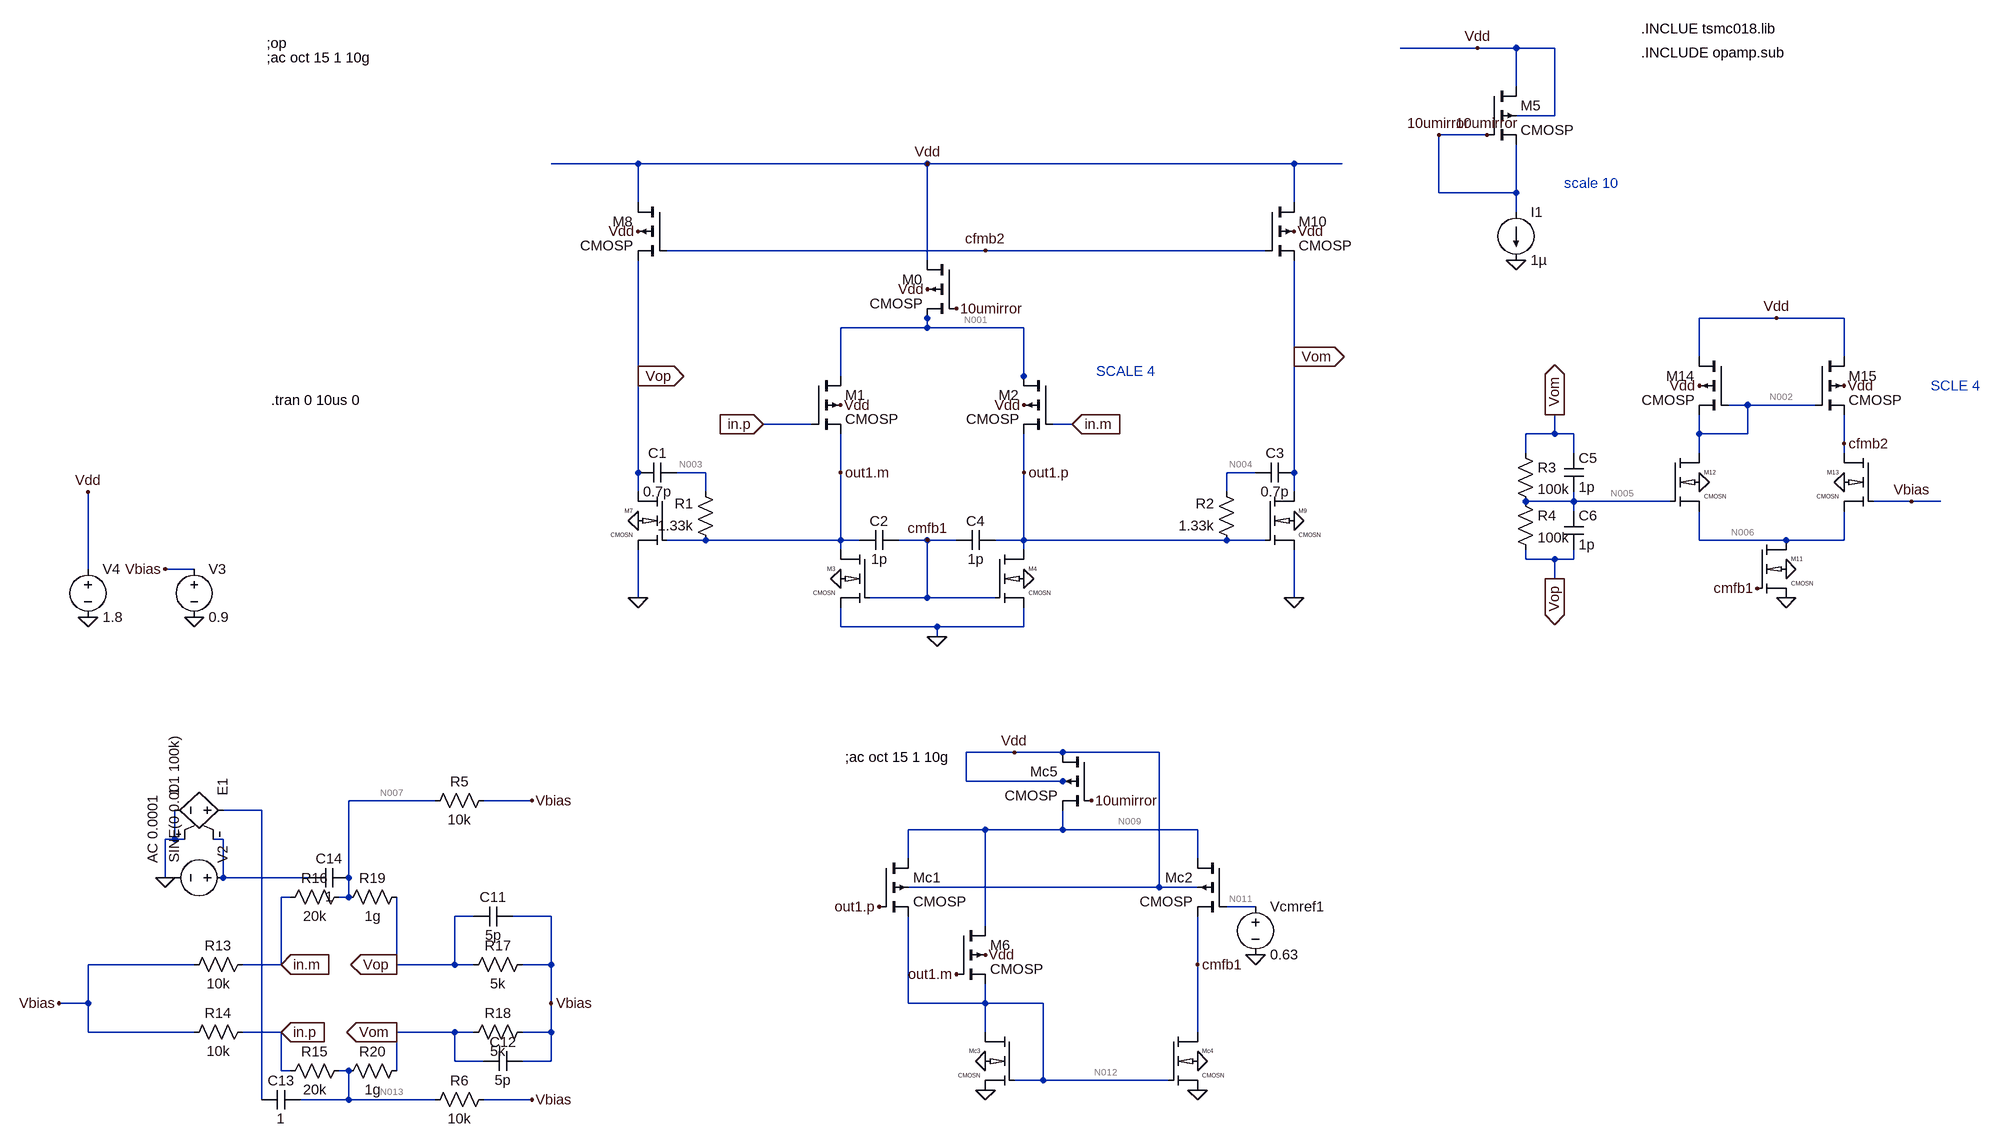
[diagram p0: schematic worked_1.asc]
worked_1.asc, the LTspice schematic file:
Version 4
SHEET 1 1904 1260
WIRE 896 -544 768 -544
WIRE 960 -544 896 -544
WIRE 1024 -544 960 -544
WIRE 960 -480 960 -544
WIRE 1024 -432 1024 -544
WIRE 1024 -432 960 -432
WIRE 912 -400 832 -400
WIRE -496 -352 -640 -352
WIRE -16 -352 -496 -352
WIRE 592 -352 -16 -352
WIRE 672 -352 592 -352
WIRE 832 -304 832 -400
WIRE 960 -304 960 -384
WIRE 960 -304 832 -304
WIRE -496 -288 -496 -352
WIRE 592 -288 592 -352
WIRE 960 -272 960 -304
WIRE 80 -208 -448 -208
WIRE 544 -208 80 -208
WIRE -16 -192 -16 -352
WIRE -16 -96 -16 -112
WIRE 1392 -96 1264 -96
WIRE 1504 -96 1392 -96
WIRE -16 -80 -16 -96
WIRE -16 -80 -160 -80
WIRE 144 -80 -16 -80
WIRE 592 -32 592 -192
WIRE 1264 -32 1264 -96
WIRE 1504 -32 1504 -96
WIRE -496 0 -496 -192
WIRE -160 0 -160 -80
WIRE 144 0 144 -80
WIRE 144 16 144 0
WIRE 1344 48 1312 48
WIRE 1456 48 1344 48
WIRE -208 80 -288 80
WIRE 224 80 192 80
WIRE 1024 96 1024 64
WIRE 1024 96 976 96
WIRE 1056 96 1024 96
WIRE 1264 96 1264 64
WIRE 1344 96 1344 48
WIRE 1344 96 1264 96
WIRE 1504 112 1504 64
WIRE 976 128 976 96
WIRE 1056 128 1056 96
WIRE 1264 128 1264 96
WIRE 1504 128 1504 112
WIRE -496 160 -496 0
WIRE -384 160 -432 160
WIRE -160 160 -160 96
WIRE 144 160 144 96
WIRE 528 160 480 160
WIRE 592 160 592 -32
WIRE -496 192 -496 160
WIRE -384 192 -384 160
WIRE 480 192 480 160
WIRE 592 192 592 160
WIRE 1056 208 1056 192
WIRE 1056 208 976 208
WIRE 1216 208 1056 208
WIRE 1616 208 1552 208
WIRE 1664 208 1616 208
WIRE 1056 224 1056 208
WIRE -384 272 -448 272
WIRE -160 272 -160 160
WIRE -160 272 -384 272
WIRE -128 272 -160 272
WIRE -16 272 -64 272
WIRE 32 272 -16 272
WIRE 144 272 144 160
WIRE 144 272 96 272
WIRE 480 272 144 272
WIRE 544 272 480 272
WIRE 1264 272 1264 224
WIRE 1408 272 1264 272
WIRE 1504 272 1504 224
WIRE 1504 272 1408 272
WIRE -160 288 -160 272
WIRE 144 288 144 272
WIRE 976 304 976 288
WIRE 1024 304 976 304
WIRE 1056 304 1056 288
WIRE 1056 304 1024 304
WIRE -1408 320 -1408 192
WIRE -1232 320 -1280 320
WIRE 1024 336 1024 304
WIRE -496 368 -496 288
WIRE -16 368 -16 272
WIRE -16 368 -112 368
WIRE 96 368 -16 368
WIRE 592 368 592 288
WIRE -160 416 -160 384
WIRE 0 416 -160 416
WIRE 144 416 144 384
WIRE 144 416 0 416
WIRE 0 432 0 416
WIRE 128 624 48 624
WIRE 208 624 128 624
WIRE 368 624 208 624
WIRE 48 672 48 624
WIRE 208 672 48 672
WIRE 224 672 208 672
WIRE -832 704 -976 704
WIRE -672 704 -752 704
WIRE -1120 720 -1184 720
WIRE 80 752 -48 752
WIRE 208 752 208 720
WIRE 208 752 80 752
WIRE 432 752 208 752
WIRE -1264 768 -1264 720
WIRE -1264 768 -1280 768
WIRE -1248 768 -1264 768
WIRE -1184 768 -1200 768
WIRE -48 800 -48 752
WIRE 432 800 432 752
WIRE -1280 832 -1280 768
WIRE -1264 832 -1280 832
WIRE -1184 832 -1184 768
WIRE -1040 832 -1184 832
WIRE -976 832 -976 704
WIRE 368 848 368 624
WIRE 368 848 -48 848
WIRE 432 848 368 848
WIRE -1072 864 -1088 864
WIRE -976 864 -976 832
WIRE -976 864 -992 864
WIRE 528 880 480 880
WIRE -768 896 -800 896
WIRE -640 896 -704 896
WIRE 80 912 80 752
WIRE -1232 976 -1408 976
WIRE -1088 976 -1088 864
WIRE -1088 976 -1152 976
WIRE -896 976 -896 864
WIRE -800 976 -800 896
WIRE -800 976 -896 976
WIRE -768 976 -800 976
WIRE -640 976 -640 896
WIRE -640 976 -688 976
WIRE 432 976 432 896
WIRE -1408 1040 -1408 976
WIRE -1408 1040 -1456 1040
WIRE -640 1040 -640 976
WIRE -48 1040 -48 896
WIRE 80 1040 80 1008
WIRE 80 1040 -48 1040
WIRE 176 1040 80 1040
WIRE -1408 1088 -1408 1040
WIRE -1232 1088 -1408 1088
WIRE -1088 1088 -1152 1088
WIRE -800 1088 -896 1088
WIRE -768 1088 -800 1088
WIRE -640 1088 -640 1040
WIRE -640 1088 -688 1088
WIRE 80 1088 80 1040
WIRE 432 1088 432 976
WIRE -800 1136 -800 1088
WIRE -752 1136 -800 1136
WIRE -640 1136 -640 1088
WIRE -640 1136 -688 1136
WIRE -1088 1152 -1088 1088
WIRE -1072 1152 -1088 1152
WIRE -976 1152 -992 1152
WIRE -896 1152 -896 1088
WIRE 176 1168 176 1040
WIRE 176 1168 128 1168
WIRE 384 1168 176 1168
WIRE -1120 1200 -1120 720
WIRE -976 1200 -976 1152
WIRE -976 1200 -1056 1200
WIRE -832 1200 -976 1200
WIRE -672 1200 -752 1200
FLAG 224 80 in.m
IOPIN 224 80 In
FLAG -288 80 in.p
IOPIN -288 80 In
FLAG -160 160 out1.m
FLAG 144 160 out1.p
FLAG 960 -192 0
FLAG 432 1184 0
FLAG 80 1184 0
FLAG 528 960 0
FLAG 80 1136 0
FLAG 432 1136 0
FLAG 896 -544 Vdd
FLAG 32 992 out1.m
FLAG -96 880 out1.p
FLAG -16 272 cmfb1
FLAG 432 976 cmfb1
FLAG 80 960 Vdd
FLAG 128 624 Vdd
FLAG 256 704 10umirror
FLAG 32 -112 10umirror
FLAG -16 -144 Vdd
FLAG 912 -400 10umirror
FLAG 832 -400 10umirror
FLAG 0 432 0
FLAG 144 336 0
FLAG -160 336 0
FLAG -1408 400 0
FLAG -496 368 0
FLAG 592 368 0
FLAG -1408 192 Vdd
FLAG 80 -208 cfmb2
FLAG 592 -32 Vom
IOPIN 592 -32 Out
FLAG -496 0 Vop
IOPIN -496 0 Out
FLAG -16 -352 Vdd
FLAG -160 48 Vdd
FLAG 144 48 Vdd
FLAG -496 240 0
FLAG 592 240 0
FLAG -496 -240 Vdd
FLAG 592 -240 Vdd
FLAG 1392 -96 Vdd
FLAG 1408 368 0
FLAG 1408 320 0
FLAG 1504 176 0
FLAG 1264 176 0
FLAG 1264 16 Vdd
FLAG 1504 16 Vdd
FLAG 1360 352 cmfb1
FLAG 1504 112 cfmb2
FLAG 1024 64 Vom
IOPIN 1024 64 Out
FLAG 1024 336 Vop
IOPIN 1024 336 Out
FLAG 1616 208 Vbias
FLAG -1088 976 in.m
IOPIN -1088 976 In
FLAG -1088 1088 in.p
IOPIN -1088 1088 In
FLAG -896 976 Vop
IOPIN -896 976 Out
FLAG -896 1088 Vom
IOPIN -896 1088 Out
FLAG -640 1040 Vbias
FLAG -1456 1040 Vbias
FLAG -1280 832 0
FLAG -1232 400 0
FLAG -1280 320 Vbias
FLAG -672 704 Vbias
FLAG -672 1200 Vbias
SYMBOL cmosn -112 288 M0
SYMATTR InstName M3
SYMATTR Value2 l=0.24u w=0.5u
SYMBOL cmosp -208 0 R0
SYMATTR InstName M1
SYMATTR Value2 l=0.24u w=8u
SYMBOL cmosp 32 -192 M0
SYMATTR InstName M0
SYMATTR Value2 l=0.24u w=16u
SYMBOL cmosp 192 0 M0
SYMATTR InstName M2
SYMATTR Value2 l=0.24u w=8u
SYMBOL cmosn 96 288 R0
SYMATTR InstName M4
SYMATTR Value2 l=0.24u w=.5u
SYMBOL cmosp 912 -480 R0
SYMATTR InstName M5
SYMATTR Value2 l=0.24u w=.64u
SYMBOL current 960 -272 R0
WINDOW 123 0 0 Left 2
WINDOW 39 0 0 Left 2
SYMATTR Value2 ""
SYMATTR SpiceLine ""
SYMATTR InstName I1
SYMATTR Value 1µ
SYMBOL voltage -1408 304 R0
WINDOW 123 0 0 Left 2
WINDOW 39 0 0 Left 2
SYMATTR Value2 ""
SYMATTR SpiceLine ""
SYMATTR InstName V4
SYMATTR Value 1.8
SYMBOL cap -64 256 R90
WINDOW 0 0 32 VBottom 2
WINDOW 3 32 32 VTop 2
SYMATTR InstName C2
SYMATTR Value 1p
SYMBOL cap 96 256 R90
WINDOW 0 0 32 VBottom 2
WINDOW 3 32 32 VTop 2
SYMATTR InstName C4
SYMATTR Value 1p
SYMBOL cmosp -96 800 R0
SYMATTR InstName Mc1
SYMATTR Value2 l=0.24u w=3.2u
SYMBOL cmosp 32 912 R0
SYMATTR InstName M6
SYMATTR Value2 l=0.24u w=3.2u
SYMBOL cmosp 480 800 M0
SYMATTR InstName Mc2
SYMATTR Value2 l=0.24u w=6.4u
SYMBOL cmosn 128 1088 M0
SYMATTR InstName Mc3
SYMATTR Value2 l=0.24u w=0.4u
SYMBOL cmosn 384 1088 R0
SYMATTR InstName Mc4
SYMATTR Value2 l=0.24u w=0.4u
SYMBOL cmosp 256 624 M0
SYMATTR InstName Mc5
SYMATTR Value2 l=0.24u w=12.8u
SYMBOL voltage 528 864 R0
WINDOW 123 0 0 Left 2
WINDOW 39 0 0 Left 2
SYMATTR Value2 ""
SYMATTR SpiceLine ""
SYMATTR InstName Vcmref1
SYMATTR Value 0.63
SYMBOL cmosn -448 192 M0
SYMATTR InstName M7
SYMATTR Value2 l=0.24u w=4u
SYMBOL cmosp -448 -288 M0
SYMATTR InstName M8
SYMATTR Value2 l=0.24u w=16u
SYMBOL cmosn 544 192 R0
SYMATTR InstName M9
SYMATTR Value2 l=0.24u w=4u
SYMBOL cmosp 544 -288 R0
SYMATTR InstName M10
SYMATTR Value2 l=0.24u w=16u
SYMBOL cap -432 144 R90
WINDOW 0 0 32 VBottom 2
WINDOW 3 32 32 VTop 2
SYMATTR InstName C1
SYMATTR Value 0.7p
SYMBOL res -368 288 R180
WINDOW 0 36 76 Left 2
WINDOW 3 36 40 Left 2
SYMATTR InstName R1
SYMATTR Value 1.33k
SYMBOL cap 528 144 M90
WINDOW 0 0 32 VBottom 2
WINDOW 3 32 32 VTop 2
SYMATTR InstName C3
SYMATTR Value 0.7p
SYMBOL res 496 288 R180
WINDOW 0 36 76 Left 2
WINDOW 3 36 40 Left 2
SYMATTR InstName R2
SYMATTR Value 1.33k
SYMBOL cmosn 1360 272 R0
SYMATTR InstName M11
SYMATTR Value2 l=0.24u w=1u
SYMBOL cmosn 1216 128 R0
SYMATTR InstName M12
SYMATTR Value2 l=0.24u w=0.5u
SYMBOL cmosn 1552 128 M0
SYMATTR InstName M13
SYMATTR Value2 l=0.24u w=0.5u
SYMBOL cmosp 1312 -32 M0
SYMATTR InstName M14
SYMATTR Value2 l=0.24u w=2u
SYMBOL cmosp 1456 -32 R0
SYMATTR InstName M15
SYMATTR Value2 l=0.24u w=2u
SYMBOL res 960 112 R0
SYMATTR InstName R3
SYMATTR Value 100k
SYMBOL res 960 192 R0
SYMATTR InstName R4
SYMATTR Value 100k
SYMBOL cap 1040 128 R0
SYMATTR InstName C5
SYMATTR Value 1p
SYMBOL cap 1040 224 R0
SYMATTR InstName C6
SYMATTR Value 1p
SYMBOL voltage -1168 832 M270
WINDOW 123 24 132 Left 2
WINDOW 39 0 0 Left 2
SYMATTR Value2 AC 0.0001
SYMATTR SpiceLine ""
SYMATTR InstName V2
SYMATTR Value SINE(0 0.001 100k)
SYMBOL e2 -1168 720 M270
SYMATTR InstName E1
SYMATTR Value 1
SYMBOL res -1136 960 R90
WINDOW 0 0 56 VBottom 2
WINDOW 3 32 56 VTop 2
SYMATTR InstName R13
SYMATTR Value 10k
SYMBOL res -1136 1072 R90
WINDOW 0 0 56 VBottom 2
WINDOW 3 32 56 VTop 2
SYMATTR InstName R14
SYMATTR Value 10k
SYMBOL res -976 1136 R90
WINDOW 0 0 56 VBottom 2
WINDOW 3 32 56 VTop 2
SYMATTR InstName R15
SYMATTR Value 20k
SYMBOL res -976 848 R90
WINDOW 0 0 56 VBottom 2
WINDOW 3 32 56 VTop 2
SYMATTR InstName R16
SYMATTR Value 20k
SYMBOL res -672 960 R90
WINDOW 0 0 56 VBottom 2
WINDOW 3 32 56 VTop 2
SYMATTR InstName R17
SYMATTR Value 5k
SYMBOL res -672 1072 R90
WINDOW 0 0 56 VBottom 2
WINDOW 3 32 56 VTop 2
SYMATTR InstName R18
SYMATTR Value 5k
SYMBOL cap -704 880 R90
WINDOW 0 0 32 VBottom 2
WINDOW 3 32 32 VTop 2
SYMATTR InstName C11
SYMATTR Value 5p
SYMBOL cap -688 1120 R90
WINDOW 0 0 32 VBottom 2
WINDOW 3 32 32 VTop 2
SYMATTR InstName C12
SYMATTR Value 5p
SYMBOL res -880 848 R90
WINDOW 0 0 56 VBottom 2
WINDOW 3 32 56 VTop 2
SYMATTR InstName R19
SYMATTR Value 1g
SYMBOL res -880 1136 R90
WINDOW 0 0 56 VBottom 2
WINDOW 3 32 56 VTop 2
SYMATTR InstName R20
SYMATTR Value 1g
SYMBOL cap -1056 1184 R90
WINDOW 0 0 32 VBottom 2
WINDOW 3 32 32 VTop 2
SYMATTR InstName C13
SYMATTR Value 1
SYMBOL cap -976 816 R90
WINDOW 0 0 32 VBottom 2
WINDOW 3 32 32 VTop 2
SYMATTR InstName C14
SYMATTR Value 1
SYMBOL voltage -1232 304 R0
WINDOW 123 0 0 Left 2
WINDOW 39 0 0 Left 2
SYMATTR Value2 ""
SYMATTR SpiceLine ""
SYMATTR InstName V3
SYMATTR Value 0.9
SYMBOL res -736 688 R90
WINDOW 0 0 56 VBottom 2
WINDOW 3 32 56 VTop 2
SYMATTR InstName R5
SYMATTR Value 10k
SYMBOL res -736 1184 R90
WINDOW 0 0 56 VBottom 2
WINDOW 3 32 56 VTop 2
SYMATTR InstName R6
SYMATTR Value 10k
TEXT 1168 -576 Left 2 !.INCLUE tsmc018.lib
TEXT 1168 -536 Left 2 !.INCLUDE opamp.sub
TEXT -1112 -552 Left 2 !;op
TEXT -152 632 Left 2 !;ac oct 15 1 10g
TEXT -1112 -528 Left 2 !;ac oct 15 1 10g
TEXT 1040 -320 Left 2 ;scale 10
TEXT 264 -8 Left 2 ;SCALE 4
TEXT 1648 16 Left 2 ;SCLE 4
TEXT -1104 40 Left 2 !.tran 0 10us 0

The netlist it stands for:
* worked_1.asc
M3 out1.m cmfb1 0 0 CMOSN l=0.24u w=0.5u
M1 N001 in.p out1.m Vdd CMOSP l=0.24u w=8u
M0 Vdd 10umirror N001 Vdd CMOSP l=0.24u w=16u
M2 N001 in.m out1.p Vdd CMOSP l=0.24u w=8u
M4 out1.p cmfb1 0 0 CMOSN l=0.24u w=.5u
M5 Vdd 10umirror 10umirror Vdd CMOSP l=0.24u w=.64u
I1 10umirror 0 1µ
V4 Vdd 0 1.8
C2 cmfb1 out1.m 1p
C4 out1.p cmfb1 1p
Mc1 N009 out1.p N012 Vdd CMOSP l=0.24u w=3.2u
M6 N009 out1.m N012 Vdd CMOSP l=0.24u w=3.2u
Mc2 N009 N011 cmfb1 Vdd CMOSP l=0.24u w=6.4u
Mc3 N012 N012 0 0 CMOSN l=0.24u w=0.4u
Mc4 cmfb1 N012 0 0 CMOSN l=0.24u w=0.4u
Mc5 Vdd 10umirror N009 Vdd CMOSP l=0.24u w=12.8u
Vcmref1 N011 0 0.63
M7 Vop out1.m 0 0 CMOSN l=0.24u w=4u
M8 Vdd cfmb2 Vop Vdd CMOSP l=0.24u w=16u
M9 Vom out1.p 0 0 CMOSN l=0.24u w=4u
M10 Vdd cfmb2 Vom Vdd CMOSP l=0.24u w=16u
C1 N003 Vop 0.7p
R1 out1.m N003 1.33k
C3 N004 Vom 0.7p
R2 out1.p N004 1.33k
M11 N006 cmfb1 0 0 CMOSN l=0.24u w=1u
M12 N002 N005 N006 0 CMOSN l=0.24u w=0.5u
M13 cfmb2 Vbias N006 0 CMOSN l=0.24u w=0.5u
M14 Vdd N002 N002 Vdd CMOSP l=0.24u w=2u
M15 Vdd N002 cfmb2 Vdd CMOSP l=0.24u w=2u
R3 Vom N005 100k
R4 N005 Vop 100k
C5 Vom N005 1p
C6 N005 Vop 1p
V2 N010 0 SINE(0 0.001 100k) AC 0.0001
E1 N008 0 0 N010 1
R13 in.m Vbias 10k
R14 in.p Vbias 10k
R15 N013 in.p 20k
R16 N007 in.m 20k
R17 Vbias Vop 5k
R18 Vbias Vom 5k
C11 Vbias Vop 5p
C12 Vbias Vom 5p
R19 Vop N007 1g
R20 Vom N013 1g
C13 N013 N008 1
C14 N007 N010 1
V3 Vbias 0 0.9
R5 Vbias N007 10k
R6 Vbias N013 10k
.model NMOS NMOS
.model PMOS PMOS
.lib standard.mos
.INCLUE tsmc018.lib
.INCLUDE opamp.sub
;op
;ac oct 15 1 10g
;ac oct 15 1 10g
* scale 10
* SCALE 4
* SCLE 4
.tran 0 10us 0
.lib tsmc018.lib
.backanno
.end

* Results of the author's LTspice run, read from the files saved beside the schematic
* Operating Point, zero values left out:
*   V(out1.m) = 632.6 mV
*   V(cmfb1) = 607.9 mV
*   V(n001) = 1.512 V
*   V(in.p) = 900 mV
*   V(vdd) = 1.8 V
*   V(10umirror) = 1.261 V
*   V(in.m) = 900 mV
*   V(out1.p) = 632.6 mV
*   V(n009) = 1.303 V
*   V(n012) = 604.6 mV
*   V(n011) = 630 mV
*   V(vop) = 899.2 mV
*   V(cfmb2) = 1.18 V
*   V(vom) = 899.2 mV
*   V(n003) = 632.6 mV
*   V(n004) = 632.6 mV
*   V(n006) = 259.2 mV
*   V(n002) = 1.206 V
*   V(n005) = 899.2 mV
*   V(vbias) = 900 mV
*   V(n013) = 900 mV
*   V(n007) = 900 mV
*   Id(M15) = 6.043 µA
*   Is(M15) = -6.043 µA
*   Id(M14) = 6.014 µA
*   Is(M14) = -6.014 µA
*   Id(M10) = 65.52 µA
*   Is(M10) = -65.52 µA
*   Id(M8) = 65.52 µA
*   Is(M8) = -65.52 µA
*   Id(Mc5) = 14.76 µA
*   Is(Mc5) = -14.76 µA
*   Id(Mc2) = 7.385 µA
*   Ib(Mc2) = 1.71 pA
*   Is(Mc2) = -7.385 µA
*   Id(M6) = 3.689 µA
*   Ib(M6) = 1.713 pA
*   Is(M6) = -3.689 µA
*   Id(Mc1) = 3.689 µA
*   Ib(Mc1) = 1.713 pA
*   Is(Mc1) = -3.689 µA
*   Id(M5) = 1 µA
*   Is(M5) = -1 µA
*   Id(M2) = 8.649 µA
*   Ib(M2) = 1.475 pA
*   Is(M2) = -8.649 µA
*   Id(M0) = 17.3 µA
*   Is(M0) = -17.3 µA
*   Id(M1) = 8.649 µA
*   Ib(M1) = 1.475 pA
*   Is(M1) = -8.649 µA
*   Id(M13) = 6.043 µA
*   Ib(M13) = -1.46 pA
*   Is(M13) = -6.043 µA
*   Id(M12) = 6.014 µA
*   Ib(M12) = -1.485 pA
*   Is(M12) = -6.014 µA
*   Id(M11) = 12.06 µA
*   Is(M11) = -12.06 µA
*   Id(M9) = 65.68 µA
*   Is(M9) = -65.68 µA
*   Id(M7) = 65.68 µA
*   Is(M7) = -65.68 µA
*   Id(Mc4) = 7.385 µA
*   Is(Mc4) = -7.385 µA
*   Id(Mc3) = 7.378 µA
*   Is(Mc3) = -7.378 µA
*   Id(M4) = 8.649 µA
*   Is(M4) = -8.649 µA
*   Id(M3) = 8.649 µA
*   Is(M3) = -8.649 µA
*   I(I1) = 1 µA
*   I(R6) = 1.288 pA
*   I(R5) = 1.288 pA
*   I(R18) = 163.6 nA
*   I(R17) = 163.6 nA
*   I(V3) = -327.2 nA
*   I(V4) = -176.2 µA
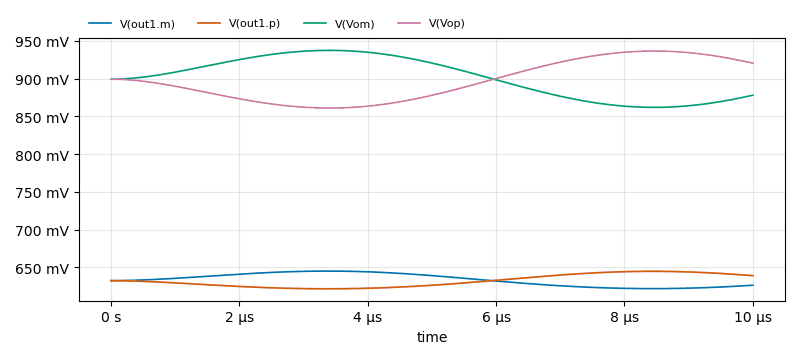
[diagram p1: Transient Analysis of worked_1.asc, plotted from the saved traces]
* Transient Analysis, 1 run:
*   V(out1.m): min 622 mV, max 645.2 mV, average 633.7 mV, rms 633.8 mV, last 626.5 mV
*   V(out1.p): min 621.8 mV, max 644.9 mV, average 632.4 mV, rms 632.4 mV, last 639.2 mV
*   V(Vom): min 861.9 mV, max 937.3 mV, average 901.4 mV, rms 901.8 mV, last 878 mV
*   V(Vop): min 861 mV, max 936.4 mV, average 896.9 mV, rms 897.3 mV, last 920.3 mV